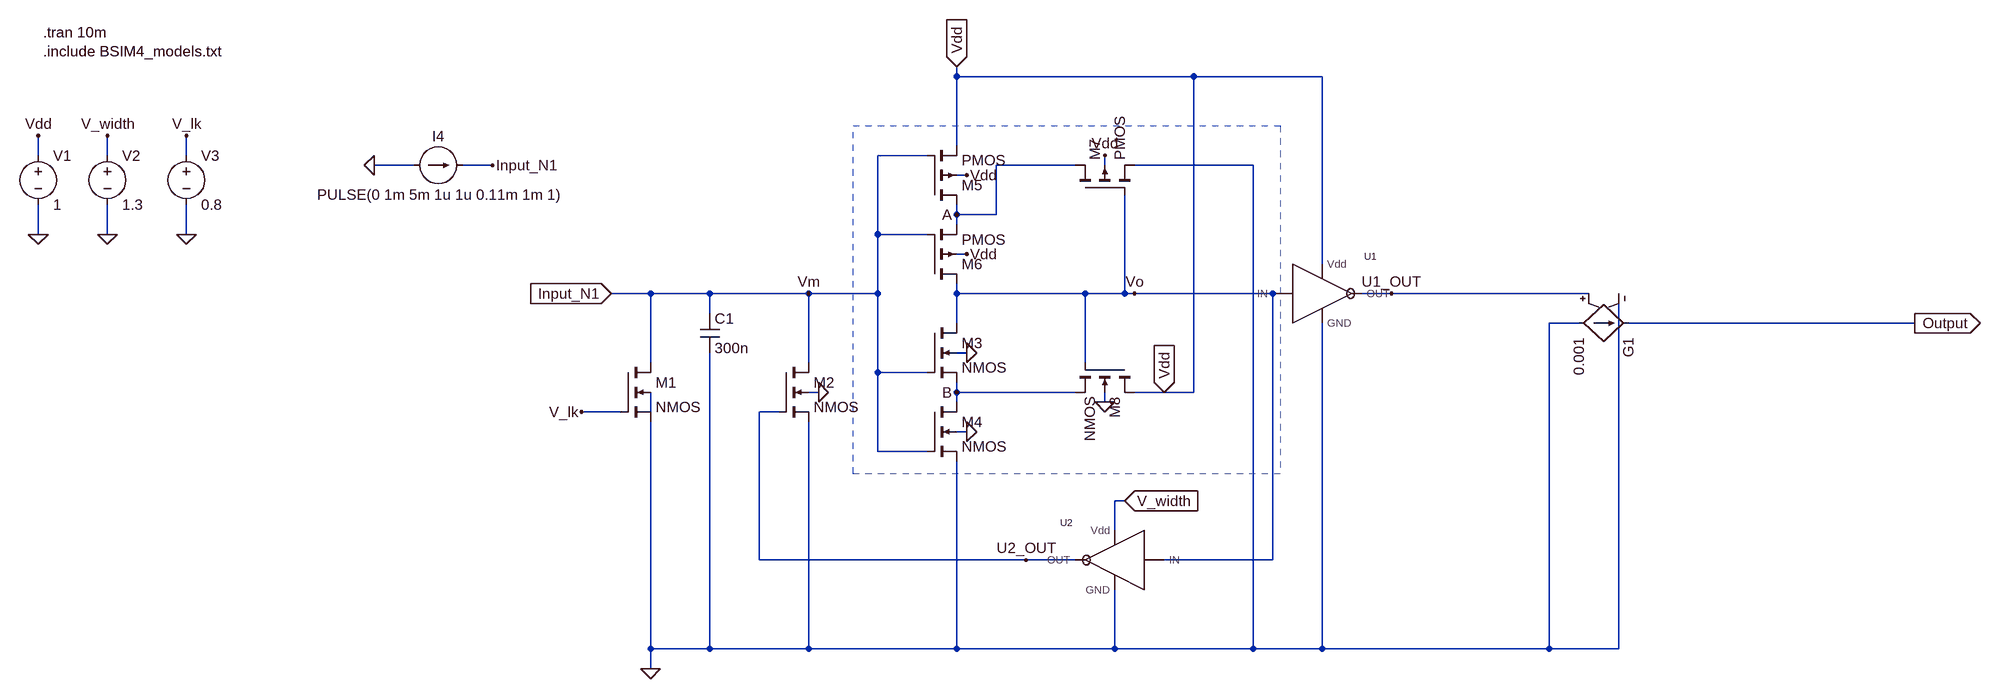
[diagram p0: schematic Neuron3_Model_Exp.asc]
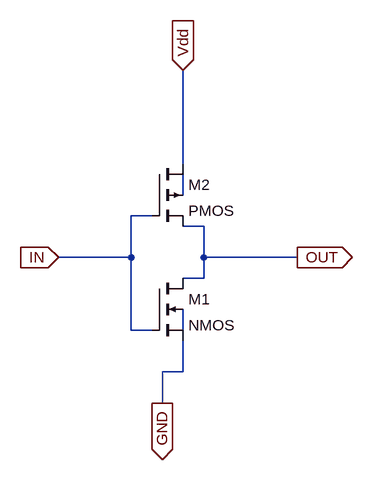
[diagram p1: sub-circuit cmos_inv.asc]
Neuron3_Model_Exp.asc, the LTspice schematic file:
Version 4
SHEET 1 4840 2960
WIRE 592 -32 592 -48
WIRE 976 -32 592 -32
WIRE 1184 -32 976 -32
WIRE 592 80 592 -32
WIRE -896 96 -896 64
WIRE -784 96 -784 64
WIRE -656 96 -656 64
WIRE 544 96 464 96
WIRE -288 112 -352 112
WIRE -160 112 -208 112
WIRE 784 112 656 112
WIRE 832 112 832 96
WIRE 1072 112 880 112
WIRE 608 128 592 128
WIRE 592 192 592 176
WIRE 656 192 656 112
WIRE 656 192 592 192
WIRE 592 208 592 192
WIRE -896 224 -896 176
WIRE -784 224 -784 176
WIRE -656 224 -656 176
WIRE 464 224 464 96
WIRE 544 224 464 224
WIRE 608 256 592 256
WIRE 1184 272 1184 -32
WIRE 96 320 32 320
WIRE 192 320 96 320
WIRE 352 320 192 320
WIRE 464 320 464 224
WIRE 464 320 352 320
WIRE 592 320 592 304
WIRE 800 320 592 320
WIRE 864 320 864 160
WIRE 864 320 800 320
WIRE 880 320 864 320
WIRE 1104 320 880 320
WIRE 1296 320 1248 320
WIRE 1616 320 1296 320
WIRE 192 352 192 320
WIRE 592 368 592 320
WIRE 1600 368 1552 368
WIRE 2144 368 1680 368
WIRE 608 416 592 416
WIRE 96 432 96 320
WIRE 352 432 352 320
WIRE 800 432 800 320
WIRE 464 448 464 320
WIRE 544 448 464 448
WIRE 368 480 352 480
WIRE 592 480 592 464
WIRE 784 480 592 480
WIRE 928 480 880 480
WIRE 976 480 976 -32
WIRE 976 480 928 480
WIRE 592 496 592 480
WIRE 832 496 832 480
WIRE 48 512 -16 512
WIRE 96 512 96 480
WIRE 304 512 272 512
WIRE 608 544 592 544
WIRE 464 576 464 448
WIRE 544 576 464 576
WIRE 864 656 848 656
WIRE 848 704 848 656
WIRE 272 752 272 512
WIRE 704 752 272 752
WIRE 784 752 704 752
WIRE 1104 752 1104 320
WIRE 1104 752 928 752
WIRE 96 896 96 528
WIRE 192 896 192 416
WIRE 192 896 96 896
WIRE 352 896 352 528
WIRE 352 896 192 896
WIRE 592 896 592 592
WIRE 592 896 352 896
WIRE 848 896 848 800
WIRE 848 896 592 896
WIRE 1072 896 1072 112
WIRE 1072 896 848 896
WIRE 1184 896 1184 368
WIRE 1184 896 1072 896
WIRE 1552 896 1552 368
WIRE 1552 896 1184 896
WIRE 1664 896 1664 320
WIRE 1664 896 1552 896
WIRE 96 928 96 896
FLAG 592 -48 Vdd
IOPIN 592 -48 In
FLAG 352 320 Vm
FLAG 880 320 Vo
FLAG 864 656 V_width
IOPIN 864 656 In
FLAG 928 480 Vdd
IOPIN 928 480 In
FLAG -16 512 V_lk
FLAG 608 128 Vdd
FLAG 608 256 Vdd
FLAG 608 416 0
FLAG 608 544 0
FLAG 832 496 0
FLAG 832 96 Vdd
FLAG 592 480 B
FLAG 592 192 A
FLAG 704 752 U2_OUT
FLAG 1296 320 U1_OUT
FLAG 368 480 0
FLAG -896 224 0
FLAG -784 224 0
FLAG -656 224 0
FLAG -896 64 Vdd
FLAG -784 64 V_width
FLAG -656 64 V_lk
FLAG 32 320 Input_N1
IOPIN 32 320 In
FLAG -352 112 0
FLAG -160 112 Input_N1
FLAG 96 928 0
FLAG 2144 368 Output
IOPIN 2144 368 Out
SYMBOL cap 176 352 R0
SYMATTR InstName C1
SYMATTR Value 300n
SYMATTR SpiceLine Rser=33k Cpar=300n
SYMBOL CMOS_INV 1168 320 R0
SYMATTR InstName U1
SYMBOL CMOS_INV 864 752 M0
SYMATTR InstName U2
SYMBOL nmos4 48 432 R0
SYMATTR InstName M1
SYMATTR Value2 l=50n w=250n
SYMBOL pmos4 784 160 R270
SYMATTR InstName M7
SYMATTR Value2 l=200n w=400n
SYMBOL nmos4 304 432 R0
SYMATTR InstName M2
SYMATTR Value2 l=5u w=500u
SYMBOL nmos4 544 368 R0
SYMATTR InstName M3
SYMATTR Value2 l=200n w=250n
SYMBOL nmos4 544 496 R0
SYMATTR InstName M4
SYMATTR Value2 l=200n w=250n
SYMBOL pmos4 544 176 M180
SYMATTR InstName M5
SYMATTR Value2 l=200n w=400n
SYMBOL pmos4 544 304 M180
SYMATTR InstName M6
SYMATTR Value2 l=200n w=400n
SYMBOL nmos4 880 432 R90
SYMATTR InstName M8
SYMATTR Value2 l=200n w=250n
SYMBOL g2 1696 368 R90
SYMATTR InstName G1
SYMATTR Value 0.001
SYMBOL voltage -896 80 R0
SYMATTR InstName V1
SYMATTR Value 1
SYMATTR SpiceLine Rser=1meg
SYMBOL voltage -784 80 R0
SYMATTR InstName V2
SYMATTR Value 1.3
SYMATTR SpiceLine Rser=1meg
SYMBOL voltage -656 80 R0
SYMATTR InstName V3
SYMATTR Value 0.8
SYMATTR SpiceLine Rser=1meg
SYMBOL current -288 112 R270
WINDOW 0 32 40 VTop 2
WINDOW 3 -32 40 VBottom 2
SYMATTR InstName I4
SYMATTR Value PULSE(0 1m 5m 1u 1u 0.11m 1m 1)
TEXT -888 -104 Left 2 !.tran 10m\n.include BSIM4_models.txt
RECTANGLE Normal 424 48 1116 612 2

cmos_inv.asc, the sub-circuit schematic file:
Version 4
SHEET 1 1000 684
WIRE 432 208 432 64
WIRE 432 256 432 224
WIRE 384 288 352 288
WIRE 464 304 432 304
WIRE 352 352 352 288
WIRE 352 352 240 352
WIRE 464 352 464 304
WIRE 608 352 464 352
WIRE 464 384 464 352
WIRE 464 384 432 384
WIRE 352 464 352 352
WIRE 384 464 352 464
WIRE 432 464 432 432
WIRE 432 528 432 480
WIRE 432 528 400 528
WIRE 400 576 400 528
FLAG 400 576 GND
IOPIN 400 576 Out
FLAG 432 64 Vdd
IOPIN 432 64 In
FLAG 240 352 IN
IOPIN 240 352 In
FLAG 608 352 OUT
IOPIN 608 352 Out
SYMBOL nmos4 384 384 R0
SYMATTR InstName M1
SYMATTR Value2 l=50n w=500n
SYMBOL pmos4 384 208 R0
SYMATTR InstName M2
SYMATTR Value2 l=50n w=1u

The netlist it stands for:
* Neuron3_Model_Exp.asc
C1 Input_N1 0 300n Rser=33k Cpar=300n
XU1 Vo Vdd 0 U1_OUT cmos_inv
XU2 Vo V_width 0 U2_OUT cmos_inv
M1 Input_N1 V_lk 0 N001 NMOS l=50n w=250n
M7 A Vo 0 Vdd PMOS l=200n w=400n
M2 Input_N1 U2_OUT 0 0 NMOS l=5u w=500u
M3 Vo Input_N1 B 0 NMOS l=200n w=250n
M4 B Input_N1 0 0 NMOS l=200n w=250n
M5 A Input_N1 Vdd Vdd PMOS l=200n w=400n
M6 Vo Input_N1 A Vdd PMOS l=200n w=400n
M8 Vdd Vo B 0 NMOS l=200n w=250n
G1 0 Output U1_OUT 0 0.001
V1 Vdd 0 1 Rser=1meg
V2 V_width 0 1.3 Rser=1meg
V3 V_lk 0 0.8 Rser=1meg
I4 0 Input_N1 PULSE(0 1m 5m 1u 1u 0.11m 1m 1)

* block symbol definitions
.subckt cmos_inv IN Vdd GND OUT
M1 OUT IN GND N002 NMOS l=50n w=500n
M2 Vdd IN OUT N001 PMOS l=50n w=1u
.ends cmos_inv

.model NMOS NMOS
.model PMOS PMOS
.lib standard.mos
.tran 10m
.include BSIM4_models.txt
.backanno
.end